# EasyEDA Pro project MSDRv2.eprj, board PCB10
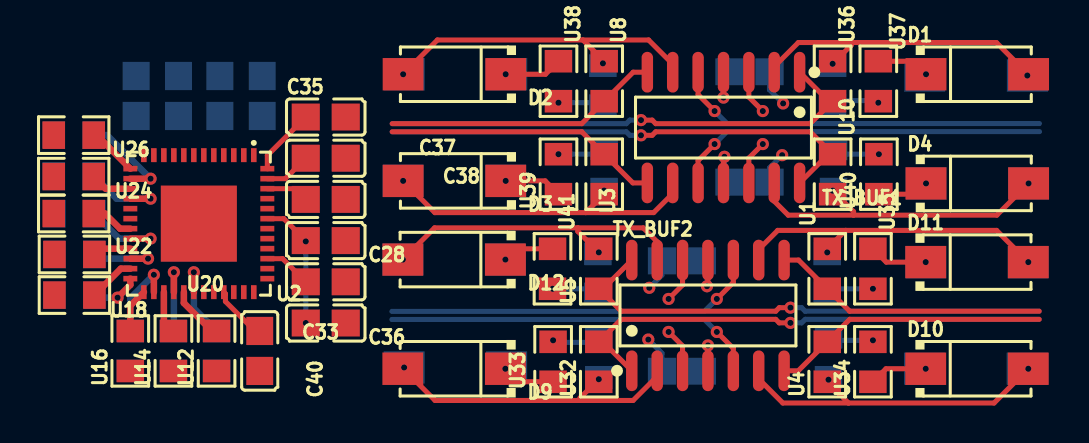
[diagram p14: board, top side]
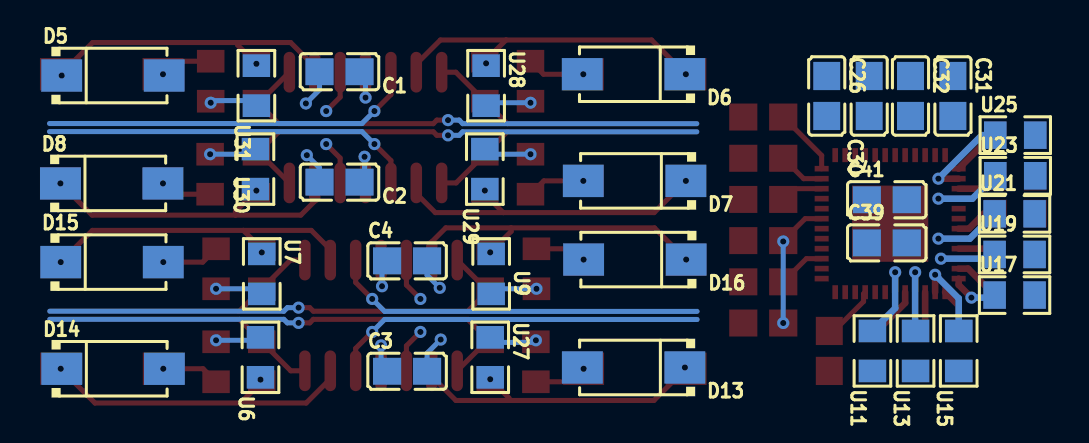
[diagram p15: board, bottom side, seen from below]

No outline. copper layers: Top Layer, Bottom Layer. Coordinates in mm from the lowest, leftmost part position.
Stack: Top Layer 0.035mm / Dielectric1 1.51mm FR4 er 4.5 / Bottom Layer 0.035mm

## Design rules (mm)
template: JLCPCB Capability(Two Layers Board)
spacing copperThickness1oz (default): track to track 0.102, other pairs 0.152 to 0.3
spacing copperThickness2oz: track to track 0.203, other pairs 0.152 to 0.3
track width copperThickness1oz (default): min 0.127, default 0.254, max 2.54
track width copperThickness2oz: min 0.203, default 0.254, max 2.54
differential pair differentialPair (default): width min 0.127, default 0.254, max 2.54; gap min 0.152, default 0.152
via viaSize (default): diameter min 0.5, default 0.61, max 10; hole min 0.3, default 0.305, max 6.3

## Placement (name value [footprint] x y rotation side)
C1  100nF  [C0805]  33.81 14.99 0 bottom
C2  100nF  [C0805]  33.81 9.46 0 bottom
C3  100nF  [C0805]  30.43 0 180 bottom
C4  100nF  [C0805]  30.43 5.52 180 bottom
C26  330nF  [C0805]  9.43 13.77 270 bottom
C28  100nF  [C0805]  12.61 6.54 180 top
C30  100nF  [C0805]  7.31 13.77 90 bottom
C31  100nF  [C0805]  3.12 13.77 270 bottom
C32  100nF  [C0805]  5.24 13.77 270 bottom
C33  100nF  [C0805]  12.61 4.48 0 top
C35  330nF  [C0805]  12.61 12.72 0 top
C36  100nF  [C0805]  12.61 2.41 180 top
C37  330nF  [C0805]  12.61 10.66 180 top
C38  100nF  [C0805]  12.61 8.6 180 top
C39  100nF  [C0805]  6.43 6.42 180 bottom
C40  100nF  [C0805]  9.31 1.02 90 top
C41  100nF  [C0805]  6.43 8.58 180 bottom
D1  -  [SMA_L4.4-W2.8-LS5.4-RD]  45.21 14.86 0 top
D2  -  [SMA_L4.4-W2.8-LS5.4-RD]  19.05 14.86 180 top
D3  -  [SMA_L4.4-W2.8-LS5.4-RD]  19.05 9.53 180 top
D4  -  [SMA_L4.4-W2.8-LS5.4-RD]  45.21 9.4 0 top
D5  -  [SMA_L4.4-W2.8-LS5.4-RD]  45.15 14.8 180 bottom
D6  -  [SMA_L4.4-W2.8-LS5.4-RD]  19.1 14.86 0 bottom
D7  -  [SMA_L4.4-W2.8-LS5.4-RD]  19.05 9.53 0 bottom
D8  -  [SMA_L4.4-W2.8-LS5.4-RD]  45.21 9.4 180 bottom
D9  -  [SMA_L4.4-W2.8-LS5.4-RD]  19.03 0.13 180 top
D10  -  [SMA_L4.4-W2.8-LS5.4-RD]  45.19 0.13 0 top
D11  -  [SMA_L4.4-W2.8-LS5.4-RD]  45.19 5.46 0 top
D12  -  [SMA_L4.4-W2.8-LS5.4-RD]  19.03 5.59 180 top
D13  -  [SMA_L4.4-W2.8-LS5.4-RD]  19.1 0.19 0 bottom
D14  -  [SMA_L4.4-W2.8-LS5.4-RD]  45.14 0.13 180 bottom
D15  -  [SMA_L4.4-W2.8-LS5.4-RD]  45.19 5.46 180 bottom
D16  -  [SMA_L4.4-W2.8-LS5.4-RD]  19.03 5.59 0 bottom
TX_BUF1  CLC4601ISO14X  [SOIC-14_L8.7-W3.9-P1.27-LS6.0-BL]  32.51 12.19 180 top
TX_BUF2  CLC4601ISO14X  [SOIC-14_L8.7-W3.9-P1.27-LS6.0-BL]  31.73 2.79 0 top
U1  1120  [R0805]  37.7 5.13 90 top
U2  MAX5864ETM+  [QFN-48_L7.0-W7.0-P0.50-BL-EP5.1]  6.26 7.39 180 top
U3  1120  [R0805]  26.54 9.86 270 top
U4  1120  [R0805]  37.7 0.48 90 top
U5  1120  [R0805]  26.27 5.13 90 top
U6  1120  [R0805]  37.76 0.7 90 bottom
U7  1120  [R0805]  37.7 4.87 270 bottom
U8  1120  [R0805]  26.54 14.51 270 top
U9  1120  [R0805]  26.22 4.87 270 bottom
U10  1120  [R0805]  37.97 9.86 270 top
U11  100  [R0805]  7.15 1.02 90 bottom
U12  100  [R0805]  7.15 1.02 90 top
U13  100  [R0805]  4.99 1.02 90 bottom
U14  100  [R0805]  4.99 1.02 90 top
U15  100  [R0805]  2.83 1.02 90 bottom
U16  100  [R0805]  2.83 1.02 90 top
U17  100  [R0805]  0.04 3.81 180 bottom
U18  100  [R0805]  0.04 3.81 180 top
U19  100  [R0805]  0.04 5.84 180 bottom
U20  100  [R0805]  0.04 5.84 180 top
U21  100  [R0805]  0.04 7.88 180 bottom
U22  100  [R0805]  0 7.89 180 top
U23  100  [R0805]  0 9.78 180 bottom
U24  100  [R0805]  0 9.74 180 top
U25  100  [R0805]  0 11.81 180 bottom
U26  100  [R0805]  0 11.81 180 top
U27  1120  [R0805]  26.27 0.7 270 bottom
U28  1120  [R0805]  26.48 14.29 270 bottom
U29  1120  [R0805]  26.54 10.11 90 bottom
U30  1120  [R0805]  38.02 10.11 90 bottom
U31  1120  [R0805]  37.97 14.29 90 bottom
U32  1120  [R0805]  26.27 0.48 90 top
U33  1120  [R0805]  23.99 0.48 90 top
U34  1120  [R0805]  39.99 0.48 90 top
U35  1120  [R0805]  39.99 5.13 270 top
U36  1120  [R0805]  37.97 14.51 270 top
U37  1120  [R0805]  40.26 14.51 270 top
U38  1120  [R0805]  24.25 14.51 270 top
U39  1120  [R0805]  24.25 9.86 90 top
U40  1120  [R0805]  40.29 9.86 90 top
U41  1120  [R0805]  23.96 5.13 270 top

## Footprints (pads in the part's own frame, mm; a bottom-side part is the same pattern mirrored in y, then rotated)
C0805
  rect 1.41x1.35 smd: 1(-1,0) 2(1,0)
QFN-48_L7.0-W7.0-P0.50-BL-EP5.1
  rect 0.28x0.7 smd: 1(-2.75,-3.428) 2(-2.25,-3.428) 3(-1.75,-3.428) 4(-1.25,-3.428) 5(-0.75,-3.428) 6(-0.25,-3.428) 7(0.25,-3.428) 8(0.75,-3.428) 9(1.25,-3.428) 10(1.75,-3.428) 11(2.25,-3.428) 12(2.75,-3.428) 25(2.75,3.428) 26(2.25,3.428) 27(1.75,3.428) 28(1.25,3.428) 29(0.75,3.428) 30(0.25,3.428) 31(-0.25,3.428) 32(-0.75,3.428) 33(-1.25,3.428) 34(-1.75,3.428) 35(-2.25,3.428) 36(-2.75,3.428)
  rect 0.7x0.28 smd: 13(3.428,-2.75) 14(3.428,-2.25) 15(3.428,-1.75) 16(3.428,-1.25) 17(3.428,-0.75) 18(3.428,-0.25) 19(3.428,0.25) 20(3.428,0.75) 21(3.428,1.25) 22(3.428,1.75) 23(3.428,2.25) 24(3.428,2.75) 37(-3.428,2.75) 38(-3.428,2.25) 39(-3.428,1.75) 40(-3.428,1.25) 41(-3.428,0.75) 42(-3.428,0.25) 43(-3.428,-0.25) 44(-3.428,-0.75) 45(-3.428,-1.25) 46(-3.428,-1.75) 47(-3.428,-2.25) 48(-3.428,-2.75)
  rect 3.81x3.81 smd: 49(0,0)
R0805
  rect 1.133x1.377 smd: 1(-1,0) 2(1,0)
SMA_L4.4-W2.8-LS5.4-RD
  rect 2.046x1.62 smd: 1(-2.566,0) 2(2.566,0)
SOIC-14_L8.7-W3.9-P1.27-LS6.0-BL
  oval 0.574x2.038 smd: 1(-3.81,-2.769) 2(-2.54,-2.769) 3(-1.27,-2.769) 4(0,-2.769) 5(1.27,-2.769) 6(2.54,-2.769) 7(3.81,-2.769) 8(3.81,2.769) 9(2.54,2.769) 10(1.27,2.769) 11(0,2.769) 12(-1.27,2.769) 13(-2.54,2.769) 14(-3.81,2.769)

## Nets
+5V: C1.1 C3.1 TX_BUF1.4 TX_BUF2.4
-5V: C2.1 C4.1 TX_BUF1.11 TX_BUF2.11
GND: C1.2 C2.2 C3.2 C4.2 C26.1 C28.1 C30.2 C31.1 C32.1 C33.2 C35.2 C36.1 C37.1 C38.1 C39.1 C40.1 C41.1 U2.5 U2.7 U2.12 U2.31 U2.32 U2.37 U2.42 U6.2 U7.2 U9.2 U27.1 U28.2 U29.2 U30.2 U31.1 U33.2 U34.2 U35.2 U37.2 U38.2 U39.2 U40.2 U41.2
VCC: C28.2 C30.1 C31.2 C32.2 C33.1 C36.2 C38.2 C39.2 C40.2 C41.2 U2.2 U2.8 U2.11 U2.18 U2.33 U2.39 U2.43 U2.46
$1I40\$1N983: D1.1 D5.2 U37.1
$1I40\$1N984: D1.2 D5.1 TX_BUF1.2 U31.2 U36.1
$1I40\$1N985: D2.2 D6.1 TX_BUF1.6 U8.1 U28.1
$1I40\$1N986: D2.1 D6.2 U38.1
$1I40\$1N987: D3.1 D7.2 U39.1
$1I40\$1N988: D3.2 D7.1 TX_BUF1.9 U3.2 U29.1
$1I40\$1N989: D4.2 D8.1 TX_BUF1.13 U10.2 U30.1
$1I40\$1N990: D4.1 D8.2 U40.1
$1I40\IN1: TX_BUF1.12
$1I40\IN2: TX_BUF1.3
$1I40\IN3: TX_BUF1.5
$1I40\IN4: TX_BUF1.10
$1I40\OUT1: TX_BUF1.14 U10.1
$1I40\OUT2: TX_BUF1.1 U36.2
$1I40\OUT3: TX_BUF1.7 U8.2
$1I40\OUT4: TX_BUF1.8 U3.1
$1I78\$1N983: D9.1 D13.2 U33.1
$1I78\$1N984: D9.2 D13.1 TX_BUF2.2 U27.2 U32.1
$1I78\$1N985: D10.2 D14.1 TX_BUF2.6 U4.1 U6.1
$1I78\$1N986: D10.1 D14.2 U34.1
$1I78\$1N987: D11.1 D15.2 U35.1
$1I78\$1N988: D11.2 D15.1 TX_BUF2.9 U1.2 U7.1
$1I78\$1N989: D12.2 D16.1 TX_BUF2.13 U5.2 U9.1
$1I78\$1N990: D12.1 D16.2 U41.1
$1I78\IN1: TX_BUF2.12
$1I78\IN2: TX_BUF2.3
$1I78\IN3: TX_BUF2.5
$1I78\IN4: TX_BUF2.10
$1I78\OUT1: TX_BUF2.14 U5.1
$1I78\OUT2: TX_BUF2.1 U32.2
$1I78\OUT3: TX_BUF2.7 U4.2
$1I78\OUT4: TX_BUF2.8 U1.1
$1I154\$1N1602: C37.2 U2.47
$1I154\$1N1605: U2.30 U11.2
$1I154\$1N1608: U2.29 U12.2
$1I154\$1N1611: U2.28 U13.2
$1I154\$1N1614: U2.27 U14.2
$1I154\$1N1617: U2.26 U15.2
$1I154\$1N1620: U2.25 U16.2
$1I154\$1N1625: U2.24 U17.1
$1I154\$1N1628: U2.23 U18.1
$1I154\$1N1633: U2.21 U20.1
$1I154\$1N1636: U2.20 U21.1
$1I154\$1N1639: U2.19 U22.1
$1I154\$1N1642: U2.16 U23.1
$1I154\$1N1645: U2.15 U24.1
$1I154\$1N1648: U2.14 U25.1
$1I154\$1N1651: U2.13 U26.1
$1I154\$1N1653: C35.1 U2.48
$1I154\$1N1654: C26.2 U2.1
$1I154\$1N1662: U2.22 U19.1
$1I154\BBC_CLK: U2.6
$1I154\BBC_DA0: U26.2
$1I154\BBC_DA1: U25.2
$1I154\BBC_DA2: U24.2
$1I154\BBC_DA3: U23.2
$1I154\BBC_DA4: U22.2
$1I154\BBC_DA5: U21.2
$1I154\BBC_DA6: U20.2
$1I154\BBC_DA7: U19.2
$1I154\BBC_DD0: U18.2
$1I154\BBC_DD1: U17.2
$1I154\BBC_DD2: U16.1
$1I154\BBC_DD3: U15.1
$1I154\BBC_DD4: U14.1
$1I154\BBC_DD5: U13.1
$1I154\BBC_DD6: U12.1
$1I154\BBC_DD7: U11.1
$1I154\CS#: U2.36
$1I154\DIN: U2.34
$1I154\RXIN: U2.4
$1I154\RXIP: U2.3
$1I154\RXQN: U2.9
$1I154\RXQP: U2.10
$1I154\SCLK: U2.35
$1I154\TXIN: U2.44
$1I154\TXIP: U2.45
$1I154\TXQN: U2.40
$1I154\TXQP: U2.41

Pads without a net: U2 17 38 49

## Via types
v1: diameter 0.61, hole 0.305, Top Layer to Bottom Layer, 62 vias

## Routing (per net, layer and track width the routed paths; a pad name or vN(x,y) marks a point on that pad's centre or on a via; arc(x,y) is an arc through that point)
+5V: length 5.4
  Top Layer w0.254: TX_BUF1.4 v1(32.51,13.69) ; TX_BUF2.4 v1(31.73,1.3)
  Bottom Layer w0.254: v1(32.51,13.69) 32.51,14.68 C1.1 ; C3.1 31.73,0.3 v1(31.73,1.3)
-5V: length 5.4
  Top Layer w0.254: v1(31.68,4.25) 31.73,4.3 TX_BUF2.11 ; TX_BUF1.11 32.51,10.68 v1(32.56,10.73)
  Bottom Layer w0.254: v1(32.56,10.73) 32.56,9.72 C2.1 ; C4.1 31.68,5.27 v1(31.68,4.25)
GND: length 25.3
  Bottom Layer w0.254: C1.2 34.81,14.08 v1(35.49,13.4) ; C2.2 34.81,10.18 v1(35.45,10.81) ; C3.2 29.43,0.91 v1(28.75,1.59) ; 26.54,10.86 v1(24.25,10.86) ; 26.27,1.44 24.09,1.44 v1(23.99,1.55) ; v1(24.25,13.44) 26.37,13.44 26.48,13.54 ; 37.7,4.13 v1(39.99,4.13) ; 37.76,1.44 37.87,1.55 v1(39.99,1.55) ; 38.02,10.86 v1(40.29,10.86) ; v1(28.8,4.18) 29.43,4.81 C4.2 ; 26.22,4.13 v1(23.96,4.13) ; v1(40.26,13.44) 40.15,13.54 37.97,13.54
VCC: length 13.9
  Top Layer w0.254: U2.33 7.59,3.88 7.59,3.49 9.06,2.02 C40.2 ; U2.46 11.07,9.14 C38.2 ; v1(11.61,6.5) C28.2 10.51,7.64 U2.43 ; U2.39 10.45,5.64 C33.1
  Bottom Layer w0.254: v1(11.61,2.41) v1(11.61,6.5)
$1I40\$1N983: length 2.7
  Top Layer w0.254: U37.1 41.99,15.51 v1(42.64,14.86)
$1I40\$1N984: length 15.6
  Top Layer w0.254: TX_BUF1.2 35.05,15.24 36.26,16.45 38.91,16.45 ; D1.2 47.75,14.86 46.16,16.45 38.91,16.45 ; 38.91,16.45 38.91,16.32 v1(37.97,15.38)
  vias: v1(47.71,14.8)
$1I40\$1N985: length 16.6
  Top Layer w0.254: TX_BUF1.6 29.97,15.37 28.76,16.57 25.48,16.57 ; v1(16.48,14.86) 18.2,16.57 25.48,16.57 ; 25.48,16.57 U8.1
  vias: v1(26.48,15.41)
$1I40\$1N986: length 2.9
  Top Layer w0.254: v1(21.61,14.86) 23.6,14.86 U38.1
$1I40\$1N987: length 2.9
  Top Layer w0.254: v1(21.61,9.53) 23.59,9.53 U39.1
$1I40\$1N988: length 16.4
  Top Layer w0.254: U3.2 25.62,7.94 ; 25.62,7.94 29.02,7.94 29.97,8.89 TX_BUF1.9 ; 25.62,7.94 18.07,7.94 v1(16.48,9.53)
  vias: v1(26.54,9.04)
$1I40\$1N989: length 16.2
  Top Layer w0.254: 39.02,7.81 35.75,7.81 35.05,8.51 TX_BUF1.13 ; 39.02,7.81 46.19,7.81 v1(47.78,9.4) ; 39.02,7.81 39.02,7.99 v1(37.97,9.04)
$1I40\$1N990: length 2.6
  Top Layer w0.254: U40.1 42.1,8.86 v1(42.64,9.4)
$1I40\IN1: length 2.2
  Top Layer w0.254: TX_BUF1.12 33.78,10.67 v1(34.48,11.37)
$1I40\IN2: length 2.2
  Top Layer w0.254: v1(34.48,13.02) 33.78,13.72 TX_BUF1.3
$1I40\IN3: length 18.8
  Top Layer w0.254: v1(32.06,13.02) 31.24,13.84 TX_BUF1.5
  Bottom Layer w0.254: 48.32,12.4 32.69,12.4 v1(32.06,13.02)
$1I40\IN4: length 18.8
  Top Layer w0.254: TX_BUF1.10 31.24,10.54 v1(32.06,11.37)
  Bottom Layer w0.254: 48.32,11.99 32.69,11.99 v1(32.06,11.37)
$1I40\OUT1: length 24.9
  Top Layer w0.254: v1(28.38,11.8) 28.94,11.8 29.12,11.98 36.85,11.98 U10.1 37.75,10.86 TX_BUF1.14
  Bottom Layer w0.254: 15.94,11.98 27.64,11.98 27.82,11.8 v1(28.38,11.8)
$1I40\OUT2: length 24.9
  Top Layer w0.254: v1(28.38,12.57) 28.94,12.57 29.12,12.39 36.85,12.39 U36.2 37.77,13.51 TX_BUF1.1
  Bottom Layer w0.254: v1(28.38,12.57) 27.82,12.57 27.64,12.39 15.94,12.39
$1I40\OUT3: length 13.8
  Top Layer w0.254: TX_BUF1.7 27.99,14.96 U8.2 25.42,12.39 15.94,12.39
$1I40\OUT4: length 13.8
  Top Layer w0.254: 15.94,11.98 25.42,11.98 U3.1 27.98,9.42 TX_BUF1.8
$1I78\$1N983: length 2.7
  Top Layer w0.254: U33.1 22.25,-0.52 v1(21.6,0.13)
$1I78\$1N984: length 15.6
  Top Layer w0.254: 25.33,-1.46 27.99,-1.46 29.19,-0.25 TX_BUF2.2 ; 25.33,-1.46 25.33,-1.33 v1(26.27,-0.4) ; 25.33,-1.46 18.08,-1.46 16.49,0.13 D9.2
  vias: v1(16.53,0.19)
$1I78\$1N985: length 16.6
  Top Layer w0.254: 38.76,-1.59 35.48,-1.59 34.27,-0.38 TX_BUF2.6 ; 38.76,-1.59 46.05,-1.59 v1(47.76,0.13) ; 38.76,-1.59 U4.1
  vias: v1(37.76,-0.42)
$1I78\$1N986: length 2.9
  Top Layer w0.254: U34.1 40.64,0.13 v1(42.63,0.13)
$1I78\$1N987: length 2.9
  Top Layer w0.254: v1(42.63,5.46) 40.65,5.46 U35.1
$1I78\$1N988: length 16.4
  Top Layer w0.254: 38.62,7.05 46.17,7.05 v1(47.76,5.46) ; 38.62,7.05 35.22,7.05 34.27,6.1 TX_BUF2.9 ; 38.62,7.05 U1.2
  vias: v1(37.7,5.95)
$1I78\$1N989: length 16.2
  Top Layer w0.254: 25.22,7.18 18.05,7.18 v1(16.47,5.59) ; 25.22,7.18 25.22,7 v1(26.27,5.95) ; 25.22,7.18 28.49,7.18 29.19,6.48 TX_BUF2.13
$1I78\$1N990: length 2.6
  Top Layer w0.254: U41.1 22.14,6.13 v1(21.6,5.59)
$1I78\IN1: length 2.2
  Top Layer w0.254: TX_BUF2.12 30.46,4.32 v1(29.76,3.62)
$1I78\IN2: length 2.2
  Top Layer w0.254: TX_BUF2.3 30.46,1.27 v1(29.76,1.97)
$1I78\IN3: length 18.8
  Top Layer w0.254: TX_BUF2.5 33,1.14 v1(32.18,1.97)
  Bottom Layer w0.254: v1(32.18,1.97) 31.55,2.59 15.92,2.59
$1I78\IN4: length 18.8
  Top Layer w0.254: v1(32.18,3.62) 33,4.45 TX_BUF2.10
  Bottom Layer w0.254: 15.92,3 31.55,3 v1(32.18,3.62)
$1I78\OUT1: length 24.9
  Top Layer w0.254: v1(35.86,3.18) 35.3,3.18 35.12,3 27.39,3 U5.1 26.49,4.13 TX_BUF2.14
  Bottom Layer w0.254: 48.31,3 36.6,3 36.42,3.18 v1(35.86,3.18)
$1I78\OUT2: length 24.9
  Top Layer w0.254: TX_BUF2.1 26.47,1.48 U32.2 27.39,2.6 35.12,2.6 35.3,2.42 v1(35.86,2.42)
  Bottom Layer w0.254: 48.31,2.6 36.6,2.6 36.42,2.42 v1(35.86,2.42)
$1I78\OUT3: length 13.8
  Top Layer w0.254: TX_BUF2.7 36.25,0.03 U4.2 38.82,2.6 48.31,2.6
$1I78\OUT4: length 13.8
  Top Layer w0.254: TX_BUF2.8 36.27,5.56 U1.1 38.82,3 48.31,3
$1I154\$1N1602: length 2.3
  Top Layer w0.254: U2.47 10.59,9.64 C37.2
$1I154\$1N1605: length 4.4
  Top Layer w0.33: U2.30 v1(6.01,4.95)
  Bottom Layer w0.33: v1(6.01,4.95) 6.01,3.16 U11.2
$1I154\$1N1608: length 2.8
  Top Layer w0.33: U2.29 5.51,3.42 6.91,2.02 U12.2
$1I154\$1N1611: length 3.9
  Top Layer w0.33: U2.28 v1(5.01,4.95)
  Bottom Layer w0.33: U13.2 5.01,2.04 v1(5.01,4.95)
$1I154\$1N1614: length 2.1
  Top Layer w0.33: U14.2 4.51,2.5 U2.27
$1I154\$1N1617: length 4.2
  Top Layer w0.33: U2.26 v1(4.01,4.83)
  Bottom Layer w0.33: v1(4.01,4.83) 2.83,3.65 U15.2
$1I154\$1N1620: length 2.2
  Top Layer w0.33: U16.2 2.83,3.28 U2.25
$1I154\$1N1625: length 2.4
  Top Layer w0.33: v1(2.19,3.69) 2.83,4.32 U2.24
  Bottom Layer w0.33: U17.1 1.16,3.69 v1(2.19,3.69)
$1I154\$1N1628: length 2.3
  Top Layer w0.33: U2.23 2.36,5.14 U18.1
$1I154\$1N1633: length 1.9
  Top Layer w0.33: U20.1 1.33,6.14 U2.21
$1I154\$1N1636: length 4.3
  Top Layer w0.33: U2.20 v1(3.85,6.64)
  Bottom Layer w0.33: v1(3.85,6.64) 2.28,6.64 U21.1
$1I154\$1N1639: length 2.1
  Top Layer w0.33: U22.1 1.56,7.89 2.32,7.14 U2.19
$1I154\$1N1642: length 4.3
  Top Layer w0.33: U2.16 v1(3.85,8.64)
  Bottom Layer w0.33: U23.1 2.15,8.64 v1(3.85,8.64)
$1I154\$1N1645: length 2.1
  Top Layer w0.33: U2.15 1.6,9.14 U24.1
$1I154\$1N1648: length 4.8
  Top Layer w0.33: U2.14 v1(3.85,9.64)
  Bottom Layer w0.33: v1(3.85,9.64) 1.67,11.81 U25.1
$1I154\$1N1651: length 2.5
  Top Layer w0.33: U2.13 1.15,11.81 U26.1
$1I154\$1N1653: length 3.4
  Top Layer w0.254: U2.48 9.69,10.8 C35.1
$1I154\$1N1662: length 3.7
  Top Layer w0.33: U2.22 v1(3.72,5.64)
  Bottom Layer w0.33: U19.1 1.24,5.64 v1(3.72,5.64)
